# Altium schematic sheet MCU.SchDoc
size 384 x 270 mm; SheetNumber: 2; SheetTotal: 4
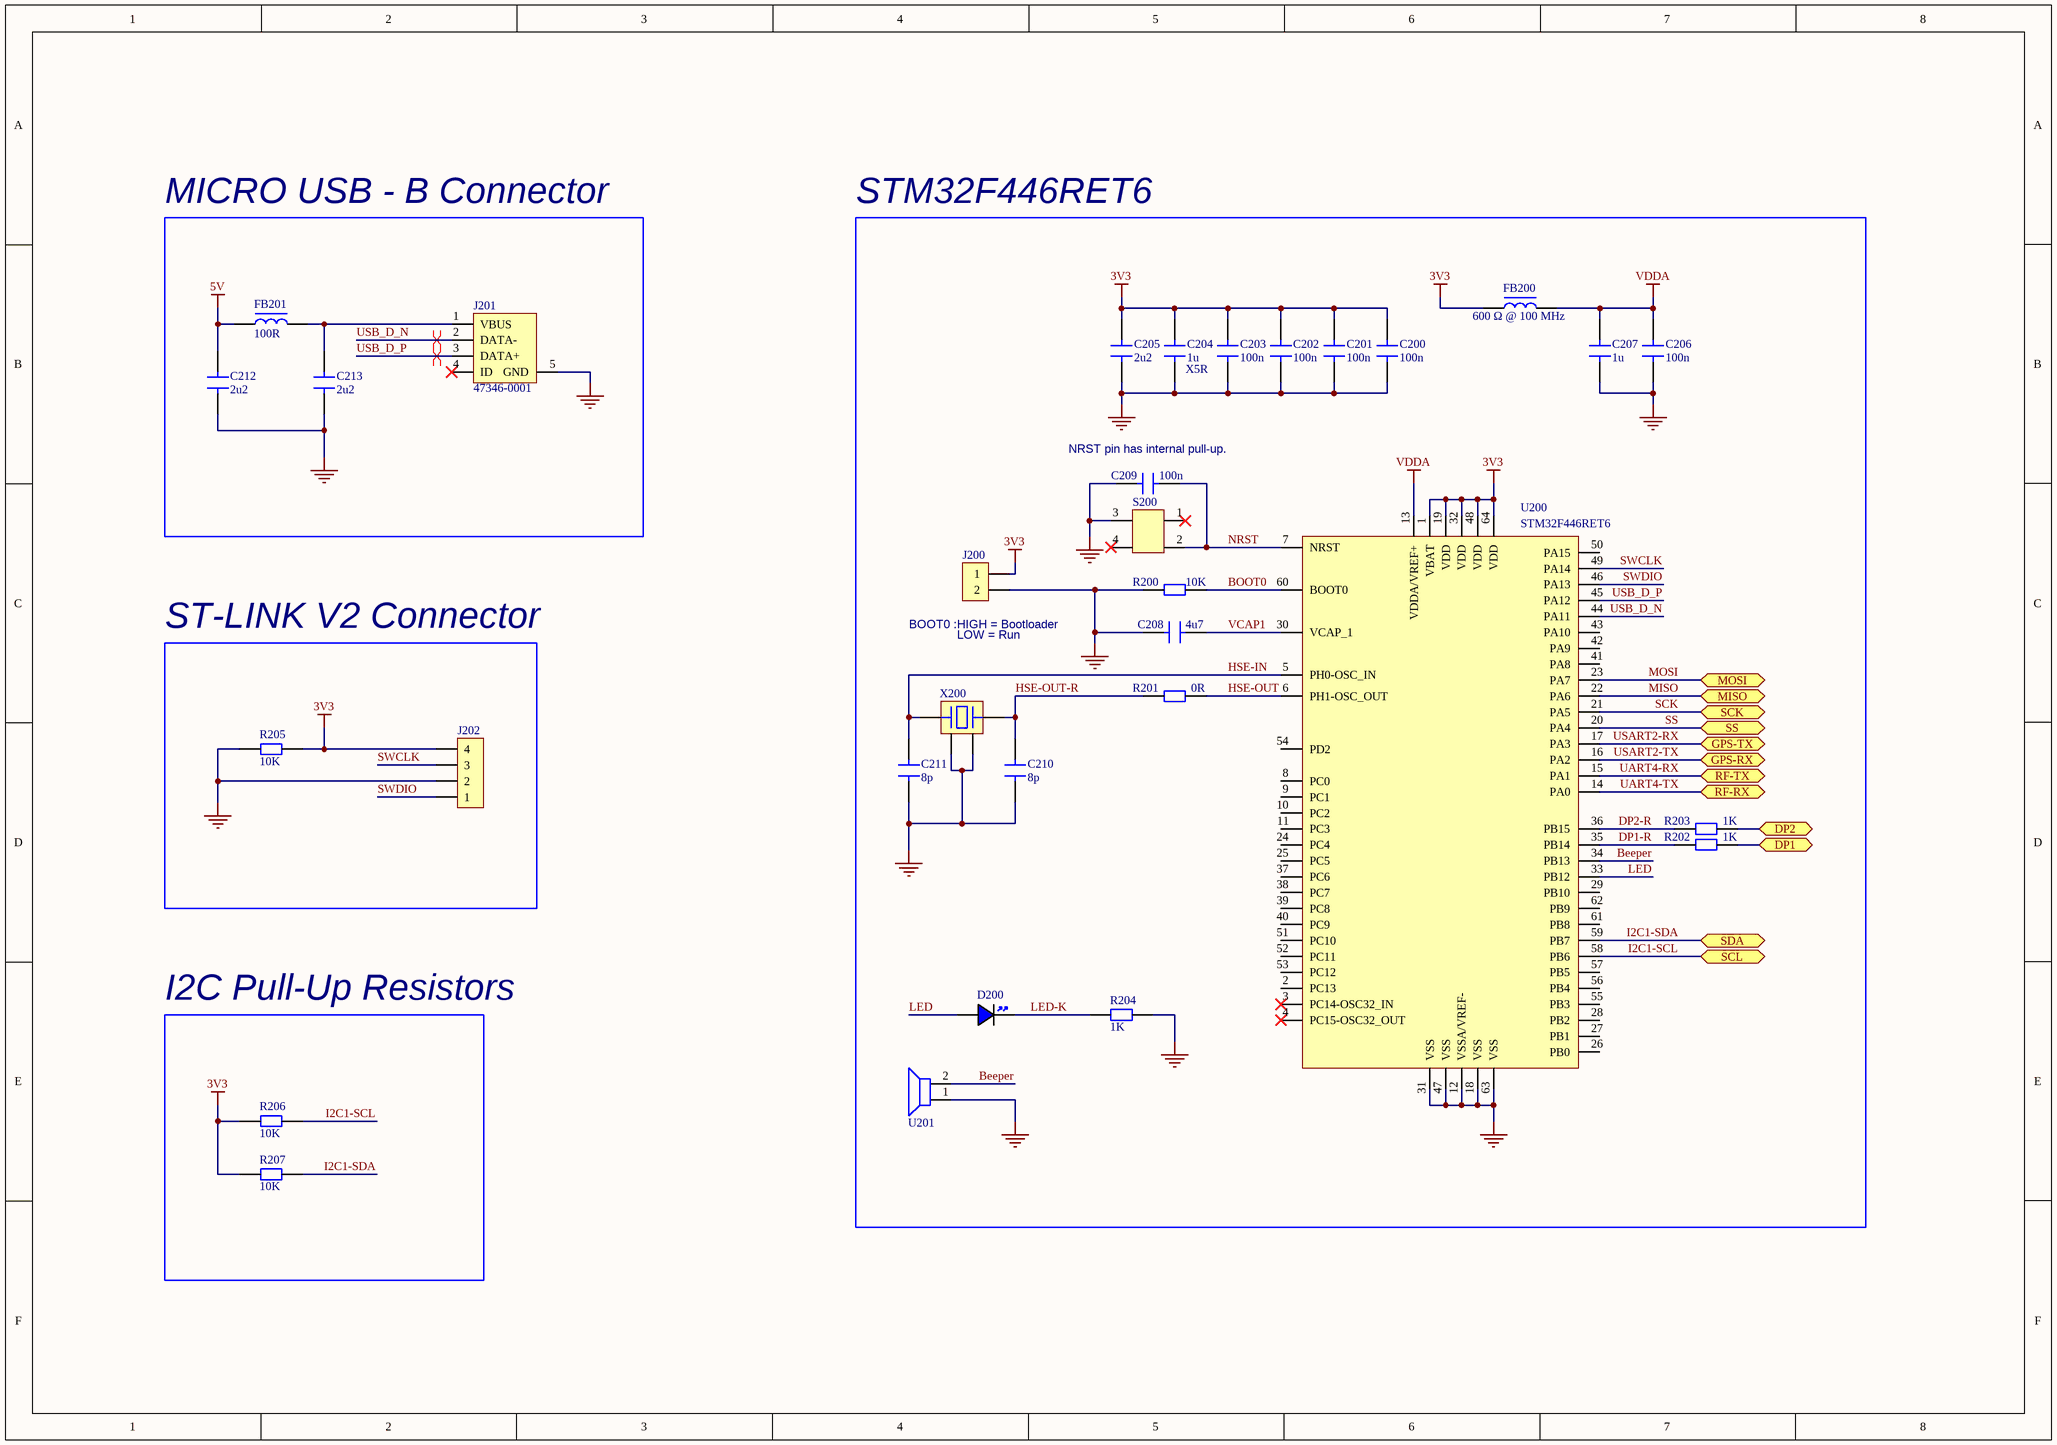
[diagram p0: MCU.SchDoc]

## Parts
C200  100n  [CAP 0603]
C201  100n  [CAP 0603]
C202  100n  [CAP 0603]
C203  100n  [CAP 0603]
C204  1u  [CAP 0603]
C205  2u2  [CAP 0603]
C206  100n  [CAP 0603]
C207  1u  [CAP 0603]
C208  4u7  [CAP 0805]
C209  100n  [CAP 0603]
C210  8p  [CAP 0603]
C211  8p  [CAP 0603]
C212  2u2  [CAP 0603]
C213  2u2  [CAP 0603]
D200  LED 0805 BLUE  [LED 0805 BLUE]  (value not drawn)
FB200  600 Ω @ 100 MHz  [FB 0603]
FB201  100R  [FB 0805]
J200  1x2 HEADER  [1x2 HEADER MALE]  (value not drawn)
J201  47346-0001  [MOLEX_47346-0001]
J202  1x4 HEADER MALE  [1X4 HEADER MALE]  (value not drawn)
R200  10K  [RES 0603]
R201  0R  [RES 0603]
R202  1K  [RES 0603]
R203  1K  [RES 0603]
R204  1K  [RES 0603]
R205  10K  [RES 0603]
R206  10K  [RES 0603]
R207  10K  [RES 0603]
S200  FSM4JSMATR  [FSM4JSMATR]  (value not drawn)
U200  STM32F446RET6  [STM32F446RET6]
U201  PS1240P02BT  [PS1240P02BT]  (value not drawn)
X200  FA-20H 16.0000MF10Z-AJ0  [FA-20H 16.0000MF10Z-AJ0]  (value not drawn)

## Blocks framed on the sheet
MICRO USB - B Connector: C212 C213 FB201 J201
STM32F446RET6: C200-C211 D200 FB200 J200 R200-R204 S200 U200 U201 X200
ST-LINK V2 Connector: J202 R205
I2C Pull-Up Resistors: R206 R207

## Ports
DP1 (bidir, see Power[1C]), DP2 (bidir, see Power[3C]), GPS-RX (bidir, see Peripheral[4C]), GPS-TX (bidir, see Peripheral[4C]), MISO (bidir, see Peripheral[1B], Peripheral[3C]), MOSI (bidir, see Peripheral[1B], Peripheral[3C]), RF-RX (bidir, see Peripheral[3C]), RF-TX (bidir, see Peripheral[3C]), SCK (bidir, see Peripheral[1B], Peripheral[3D]), SCL (bidir, see Peripheral[2C], Peripheral[3A], Peripheral[3C]), SDA (bidir, see Peripheral[2C], Peripheral[3A], Peripheral[3C]), SS (bidir, see Peripheral[1B], Peripheral[3C])

## Nets
3V3: C200.2 C201.2 C202.2 C203.2 C204.2 C205.2 FB200.1 J200.1 J202.4 R205.2 R206.2 R207.2 U200.1(VBAT) U200.19(VDD) U200.32(VDD) U200.48(VDD) U200.64(VDD)
5V: C212.1 FB201.1
GND: C200.1 C201.1 C202.1 C203.1 C204.1 C205.1 C206.1 C207.1 C208.1 C209.1 C210.1 C211.1 C212.2 C213.2 J200.2 J201.5(GND) J202.2 R200.1 R204.2 R205.1 S200.3 U200.12(VSSA/VREF-) U200.18(VSS) U200.31(VSS) U200.47(VSS) U200.63(VSS) U201.1 X200.2 X200.4
VDDA: C206.2 C207.2 FB200.2 U200.13(VDDA/VREF+)
Beeper: U200.34(PB13) U201.2
BOOT0: R200.2 U200.60(BOOT0)
DP1: R202.1 ; port DP1
DP1-R: R202.2 U200.35(PB14)
DP2: R203.2 ; port DP2
DP2-R: R203.1 U200.36(PB15)
HSE-IN: C211.2 U200.5(PH0-OSC_IN) X200.1
HSE-OUT: R201.2 U200.6(PH1-OSC_OUT)
HSE-OUT-R: C210.2 R201.1 X200.3
I2C1-SCL: R206.1 U200.58(PB6) ; port SCL
I2C1-SDA: R207.1 U200.59(PB7) ; port SDA
LED: D200.A U200.33(PB12)
LED-K: D200.K R204.1
MISO: U200.22(PA6) ; port MISO
MOSI: U200.23(PA7) ; port MOSI
NRST: C209.2 S200.2 U200.7(NRST)
SCK: U200.21(PA5) ; port SCK
SS: U200.20(PA4) ; port SS
SWCLK: J202.3 U200.49(PA14)
SWDIO: J202.1 U200.46(PA13)
UART4-RX: U200.15(PA1) ; port RF-TX
UART4-TX: U200.14(PA0) ; port RF-RX
USART2-RX: U200.17(PA3) ; port GPS-TX
USART2-TX: U200.16(PA2) ; port GPS-RX
USB_D_N: J201.2(DATA-) U200.44(PA11)
USB_D_P: J201.3(DATA+) U200.45(PA12)
VCAP1: C208.2 U200.30(VCAP_1)
NetC213_1: C213.1 FB201.2 J201.1(VBUS)

Not connected (* = marked no-connect by the designer): J201 4(ID)*; S200 1* 4*; U200 2(PC13) 3(PC14-OSC32_IN)* 4(PC15-OSC32_OUT)* 8(PC0) 9(PC1) 10(PC2) 11(PC3) 24(PC4) 25(PC5) 26(PB0) 27(PB1) 28(PB2) 29(PB10) 37(PC6) 38(PC7) 39(PC8) 40(PC9) 41(PA8) 42(PA9) 43(PA10) 50(PA15) 51(PC10) 52(PC11) 53(PC12) 54(PD2) 55(PB3) 56(PB4) 57(PB5) 61(PB8) 62(PB9)

## Layout directives
differential pair; differential pair class DIFF_USB: USB_D_N, USB_D_P

## Notes on the sheet
- (near C204) X5R
- (near C209) NRST pin has internal pull-up.
- (near J200) BOOT0 :
- (near J200) HIGH = Bootloader
- (near J200) LOW = Run
- DWG NO:
- REV:
- THIS DOCUMENT AND THE DATA DISCLOSED HEREIN OR
- HEREWITH IS THE PROPERTY OF ALTIUM LIMITED AND MAY
- BE FREELY DISTRIBUTED IN WHOLE. NO RIGHTS ARE
- RESERVED OR EXPRESS OR IMPLIED WARANTEE GIVEN.
- REVISION
- DESCRIPTION
- DATE
- APPROVED
- ENG:
- APPROVALS
- PROJECT
- DSN:
- CHK:
- REFERENCE DOCUMENTS
- PROJECT REVISION:
- TITLE
- DOCUMENT REVISION:
- DESIGN ITEM:
- BOM:
- FAB DWG:
- PCB DWG:
- ASSY DWG:
- SCALE:
- A2
- SIZE
- CAGE CODE
- FILE NAME
- DWG NO.
- SHEET
- OF
- REV

## Library data of the parts
C200-C203 C205-C207 C209-C213 = CAP 0603 50V: Capacitor SMD 0603 50V
C204 = CAP 0603 16V: Capacitor SMD 0603 16V
C208 = CAP 0805 25V: Capacitor SMD 0805 25V
D200 = LED 0805 BLUE: LED 0805 GREEN SMD
FB200 = FB 0603: Ferrite Bead SMD 0603
FB201 = FB 0805: Ferrite Bead SMD 0805
J201 = 47346-0001: Micro-USB B Receptacle with Flange, Bottom Mount, Surface Mount, Lead-Free; Manufacturer: Molex; Max Voltage Rating (AC): 30V; Number of Ports: 1; Contact Resistance: 40mR; Current Rating: 1.8A; Gender: Female; Connector Type: USB,Receptacle; Number of Contacts: 5; Contact Current Rating: 1A; USB Standard: USB 2.0; Pitch: 0.65mm; Glow Wire Compliant: Non-compliant; Supplier 1: Sager Electronics; Manufacturer Part Number: 47346-0001; RoHS: Yes; Category: Headers and Wire Housings; Stock 1: 14156; Pricing 1: 14000=0,5225 (USD); Mount: Surface Mount; Contact Plating: Gold; Contact Material: Copper Alloy,Copper; Housing Material: Polymer; Color: Black; Min Operating Temperature: -20°C; Max Operating Temperature: 85°C; Packaging: Tape and Reel; Termination: SMD/SMT; Orientation: Right Angle; Voltage Rating (AC): 30V; Voltage Rating: 30V; Number of Circuits: 5; Number of Positions: 5; Number of Rows: 1; Series: 47346; RoHS Compliant: Yes; Halogen Free: Low Halogen; Lead Free: Lead Free; Flammability Rating: UL94 V-0; Reach SVHC Compliant: Unknown; ComponentLink1URL: https://datasheet.ciiva.com/30075/304740473460001-io-nectors-30075527.pdf?src-supplier=Onlinecomponents.com; ComponentLink1Description: https://datasheet.ciiva.com/30075/304740473460001-io-nectors-30075527.pdf?src-supplier=Onlinecomponents.com; ComponentLink2URL: https://datasheet.ciiva.com/22654/1630785-22654942.pdf?src-supplier=Element14; ComponentLink2Description: https://datasheet.ciiva.com/22654/1630785-22654942.pdf?src-supplier=Element14; ComponentLink3URL: https://datasheet.ciiva.com/16148/1700180473460001-io-nectors-16148917.pdf?src-supplier=Onlinecomponents.com; ComponentLink3Description: https://datasheet.ciiva.com/16148/1700180473460001-io-nectors-16148917.pdf?src-supplier=Onlinecomponents.com; ComponentLink4URL: https://datasheet.ciiva.com/16986/70266948-16986683.pdf?src-supplier=Allied+Electronics; ComponentLink4Description: https://datasheet.ciiva.com/16986/70266948-16986683.pdf?src-supplier=Allied+Electronics; ComponentLink5URL: https://datasheet.ciiva.com/28504/0473460001-io-connectors-28504587.pdf?src-supplier=Element14; ComponentLink5Description: https://datasheet.ciiva.com/28504/0473460001-io-connectors-28504587.pdf?src-supplier=Element14; ComponentLink6URL: https://datasheet.ciiva.com/46390/1681853-46390956.pdf?src-supplier=Element14; ComponentLink6Description: https://datasheet.ciiva.com/46390/1681853-46390956.pdf?src-supplier=Element14
R200-R207 = RES 0603: Resistor SMD 0603
S200 = FSM4JSMATR: Switch Tactile OFF (ON) SPST Round Button Gull Wing 0.05A 24VDC 1.57N SMD T/R; Manufacturer: TE Connectivity Alcoswitch; Supplier 1: Digi-Key; Manufacturer Part Number: FSM4JSMATR; RoHS: Yes; Category: Pushbutton Switches; Stock 1: 84996; Pricing 1: 1=0,36, 10=0,351, 25=0,33, 100=0,2866, 250=0,26, 500=0,24188 (USD); ComponentLink1URL: https://datasheet.ciiva.com/16320/eng-cs-1308111-1-switches-core-program-catalog-0308-16320065.pdf?src-supplier=Future+Electronics; ComponentLink1Description: https://datasheet.ciiva.com/16320/eng-cs-1308111-1-switches-core-program-catalog-0308-16320065.pdf?src-supplier=Future+Electronics; ComponentLink2URL: https://datasheet.ciiva.com/1530/1683375-1530944.pdf?src-supplier=Element14; ComponentLink2Description: https://datasheet.ciiva.com/1530/1683375-1530944.pdf?src-supplier=Element14; ComponentLink3URL: https://datasheet.ciiva.com/23765/1486934-23765878.pdf?src-supplier=Newark; ComponentLink3Description: https://datasheet.ciiva.com/23765/1486934-23765878.pdf?src-supplier=Newark; ComponentLink4URL: https://datasheet.ciiva.com/7638/921681-7638037.pdf?src-supplier=Element14; ComponentLink4Description: https://datasheet.ciiva.com/7638/921681-7638037.pdf?src-supplier=Element14
U200 = STM32F446RET6: ARM® Cortex®-M4 STM32 F4 Microcontroller IC 32-Bit 180MHz 512KB (512K x 8) FLASH 64-LQFP (10x10); Manufacturer: STMicroelectronics; Supplier 1: Mouser; Manufacturer Part Number: STM32F446RET6; RoHS: Yes; Category: Microcontrollers; Stock 1: 2954; Pricing 1: 1=12,45, 10=11,25, 50=10,54, 100=9,5, 1000=6,72, 10000=6,72 (USD); ComponentLink1URL: http://www.mouser.com/ds/2/389/stm32f446mc-956216.pdf?src-supplier=Mouser; ComponentLink1Description: http://www.mouser.com/ds/2/389/stm32f446mc-956216.pdf?src-supplier=Mouser; ComponentLink2URL: http://www.farnell.com/datasheets/2309063.pdf?src-supplier=Farnell; ComponentLink2Description: http://www.farnell.com/datasheets/2309063.pdf?src-supplier=Farnell; ComponentLink3URL: https://datasheet.octopart.com/STM32F446RET6-STMicroelectronics-datasheet-58295083.pdf?src-supplier=Future+Electronics; ComponentLink3Description: https://datasheet.octopart.com/STM32F446RET6-STMicroelectronics-datasheet-58295083.pdf?src-supplier=Future+Electronics; ComponentLink4URL: http://www.st.com/content/ccc/resource/technical/document/datasheet/65/cb/75/50/53/d6/48/24/DM00141306.pdf/files/DM00141306.pdf/jcr:content/translations/en.DM00141306.pdf?src-supplier=Digi-Key; ComponentLink4Description: http://www.st.com/content/ccc/resource/technical/document/datasheet/65/cb/75/50/53/d6/48/24/DM00141306.pdf/files/DM00141306.pdf/jcr:content/translations/en.DM00141306.pdf?src-supplier=Digi-Key; ComponentLink5URL: http://www.farnell.com/datasheets/2309063.pdf?src-supplier=Element14; ComponentLink5Description: http://www.farnell.com/datasheets/2309063.pdf?src-supplier=Element14; ComponentLink6URL: https://datasheet.octopart.com/STM32F446RET6-STMicroelectronics-datasheet-41797127.pdf?src-supplier=Element14; ComponentLink6Description: https://datasheet.octopart.com/STM32F446RET6-STMicroelectronics-datasheet-41797127.pdf?src-supplier=Element14; ComponentLink7URL: http://www.farnell.com/datasheets/2309063.pdf?src-supplier=Newark; ComponentLink7Description: http://www.farnell.com/datasheets/2309063.pdf?src-supplier=Newark; ComponentLink8URL: https://datasheet.octopart.com/STM32F446RET6-STMicroelectronics-datasheet-83961502.pdf?src-supplier=SHENGYU+ELECTRONICS; ComponentLink8Description: https://datasheet.octopart.com/STM32F446RET6-STMicroelectronics-datasheet-83961502.pdf?src-supplier=SHENGYU+ELECTRONICS
U201 = PS1240P02BT: Audio Buzzer Piezo 30Vo-p 3Vo-p 70dBA Through Hole Pin Ammo; Manufacturer: TDK; Supplier 1: CoreStaff; Manufacturer Part Number: PS1240P02BT; RoHS: Yes; Category: Audio Products; Stock 1: 34; Pricing 1: 1=156, 10=90, 50=60, 100=45, 500=39, 1000=34,5, 2000=30, 4000=29,1 (JPY); ComponentLink1URL: https://datasheet.ciiva.com/0/ef532-ps-112.pdf?src-supplier=Digi-Key; ComponentLink1Description: https://datasheet.ciiva.com/0/ef532-ps-112.pdf?src-supplier=Digi-Key; ComponentLink2URL: https://datasheet.ciiva.com/0/ef532-ps-111.pdf?src-supplier=Digi-Key; ComponentLink2Description: https://datasheet.ciiva.com/0/ef532-ps-111.pdf?src-supplier=Digi-Key; ComponentLink3URL: https://datasheet.ciiva.com/3306/ef532-ps-3306958.pdf?src-supplier=Avnet; ComponentLink3Description: https://datasheet.ciiva.com/3306/ef532-ps-3306958.pdf?src-supplier=Avnet; ComponentLink4URL: https://datasheet.ciiva.com/16225/ef532-ps-16225062.pdf?src-supplier=Onlinecomponents.com; ComponentLink4Description: https://datasheet.ciiva.com/16225/ef532-ps-16225062.pdf?src-supplier=Onlinecomponents.com
X200 = FA-20H 16.0000MF10Z-AJ0: Crystal 16MHz ±10ppm (Tol) ±10ppm (Stability) 8pF FUND 80Ohm 4-Pin Ultra Mini-CSMD T/R; Manufacturer: Epson; Supplier 1: Digi-Key; Manufacturer Part Number: FA-20H 16.0000MF10Z-AJ0; RoHS: Yes; Category: Crystals; Stock 1: 229665; Pricing 1: 1=0,73, 10=0,606, 50=0,5454, 100=0,4848, 500=0,46056 (USD); ComponentLink1URL: https://support.epson.biz/td/api/doc_check.php?dl=brief_FA-20H&amp;lang=en&src-supplier=Digi-Key; ComponentLink1Description: https://support.epson.biz/td/api/doc_check.php?dl=brief_FA-20H&amp;lang=en&src-supplier=Digi-Key; ComponentLink2URL: https://www5.epsondevice.com/en/information/support/pdf/june_2018_psc_masterbook.pdf?src-supplier=Digi-Key; ComponentLink2Description: https://www5.epsondevice.com/en/information/support/pdf/june_2018_psc_masterbook.pdf?src-supplier=Digi-Key; ComponentLink3URL: https://www.eea.epson.com/wp-content/uploads/2016/11/November-2016-PCS-MASTER-BOOK.pdf?src-supplier=Digi-Key; ComponentLink3Description: https://www.eea.epson.com/wp-content/uploads/2016/11/November-2016-PCS-MASTER-BOOK.pdf?src-supplier=Digi-Key